# Altium schematic sheet 5_non_volatile_memory.schdoc: Non Volatile Memory
size A4; Engineer: Eng_2_ALT; Revision: v0.7; SheetNumber: 5; SheetTotal: 6; Designed by: André M. P. Mattos; Version: v0.7; ProjectCode: obdh2
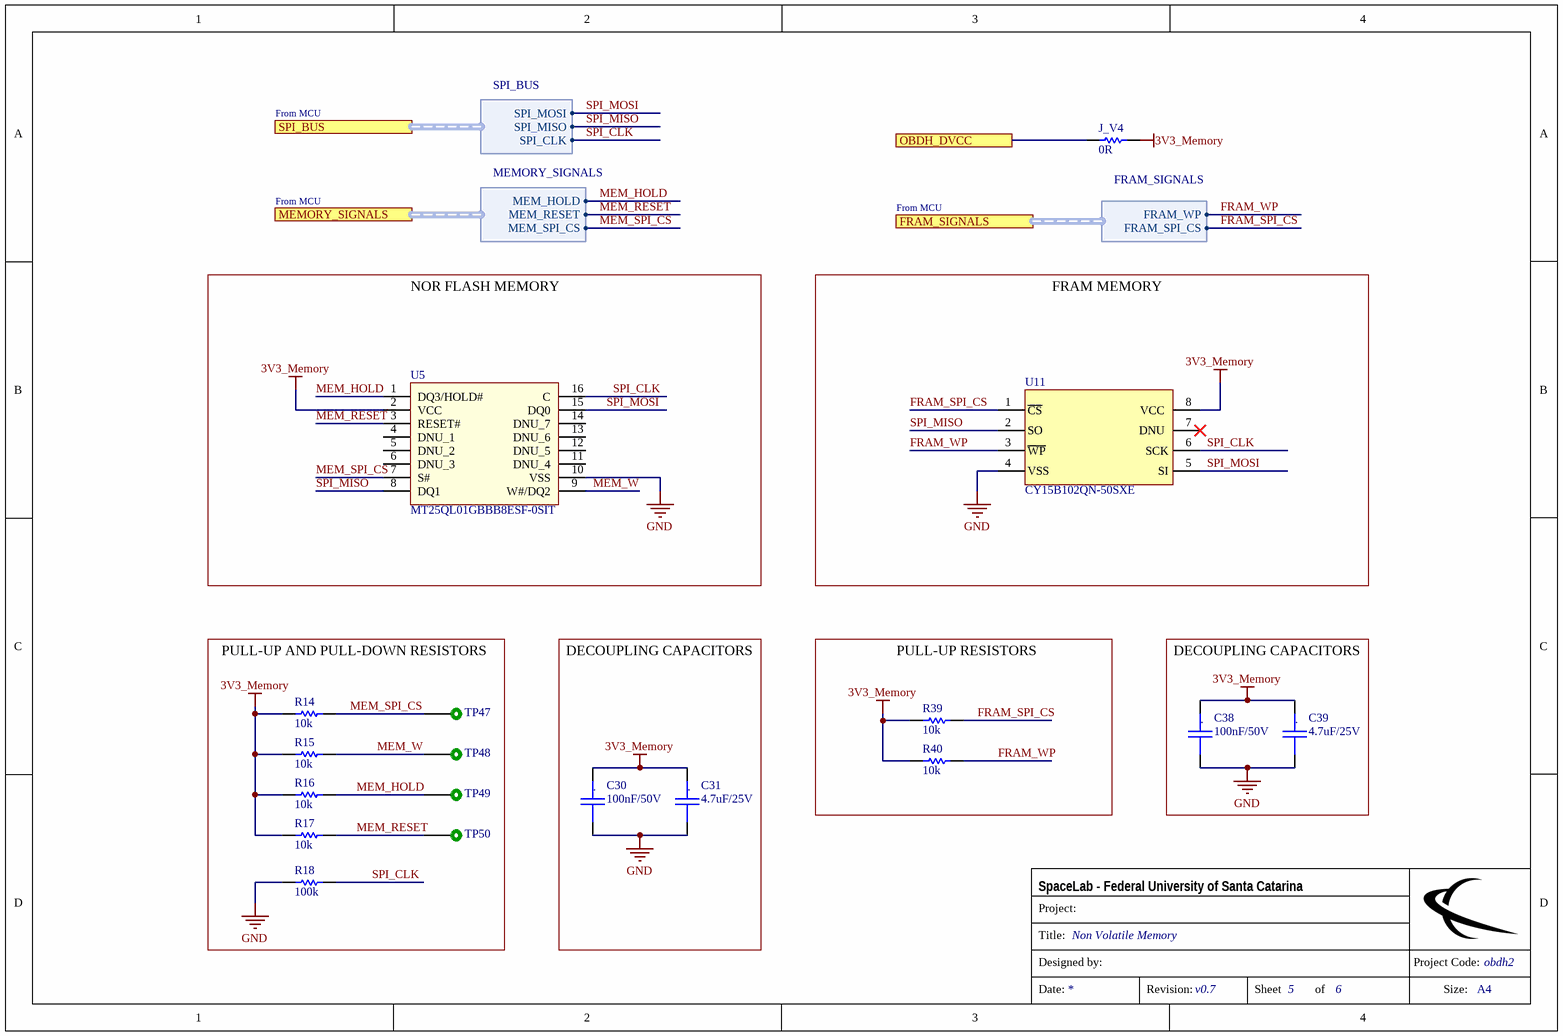
[diagram p0: 5_non_volatile_memory.schdoc]

## Parts
C30  100nF/50V  [CC0805]
C31  4.7uF/25V  [CC0805]
C38  100nF/50V  [CC0805]
C39  4.7uF/25V  [CC0805]
J_V4  0R  [0805]
R14  10k  [0805]
R15  10k  [0805]
R16  10k  [0805]
R17  10k  [0805]
R18  100k  [0805]
R39  10k  [0805]
R40  10k  [0805]
TP47  TEST_POINT_2  [TEST_POINT_2]  (value not drawn)  (no BOM)
TP48  TEST_POINT_2  [TEST_POINT_2]  (value not drawn)  (no BOM)
TP49  TEST_POINT_2  [TEST_POINT_2]  (value not drawn)  (no BOM)
TP50  TEST_POINT_2  [TEST_POINT_2]  (value not drawn)  (no BOM)
U5  MT25QL01GBBB8ESF-0SIT  [SOIC127P1032X265-16N]
U11  CY15B102QN-50SXE  [SOIC8]

## Blocks framed on the sheet
NOR FLASH MEMORY: U5
FRAM MEMORY: U11
PULL-UP AND PULL-DOWN RESISTORS: R14-R18 TP47-TP50
DECOUPLING CAPACITORS: C30 C31
PULL-UP RESISTORS: R39 R40
DECOUPLING CAPACITORS: C38 C39

## Ports
FRAM_SIGNALS (harness FRAM_SIGNALS), MEMORY_SIGNALS (harness MEMORY_SIGNALS), OBDH_DVCC, SPI_BUS (harness SPI_BUS)

## Harnesses
SPI_BUS: SPI_CLK, SPI_MISO, SPI_MOSI
MEMORY_SIGNALS: MEM_SPI_CS, MEM_RESET, MEM_HOLD
FRAM_SIGNALS: FRAM_SPI_CS, FRAM_WP

## Nets
3V3_Memory: C30.1 C31.1 C38.1 C39.1 J_V4.1 R14.2 R15.2 R16.2 R17.2 R39.2 R40.2 U5.2(VCC) U11.8(VCC)
GND: C30.2 C31.2 C38.2 C39.2 R18.2 U5.10(VSS) U11.4(VSS)
FRAM_SPI_CS: R39.1 U11.1(~{CS}) ; port FRAM_SIGNALS.FRAM_SPI_CS
FRAM_WP: R40.1 U11.3(~{WP}) ; port FRAM_SIGNALS.FRAM_WP
MEM_HOLD: R16.1 TP49.1 U5.1(DQ3/HOLD#) ; port MEMORY_SIGNALS.MEM_HOLD
MEM_RESET: R17.1 TP50.1 U5.3(RESET#) ; port MEMORY_SIGNALS.MEM_RESET
MEM_SPI_CS: R14.1 TP47.1 U5.7(S#) ; port MEMORY_SIGNALS.MEM_SPI_CS
MEM_W: R15.1 TP48.1 U5.9(W#/DQ2)
OBDH_DVCC: J_V4.2 ; port OBDH_DVCC
SPI_CLK: R18.1 U5.16(C) U11.6(SCK) ; port SPI_BUS.SPI_CLK
SPI_MISO: U5.8(DQ1) U11.2(SO) ; port SPI_BUS.SPI_MISO
SPI_MOSI: U5.15(DQ0) U11.5(SI) ; port SPI_BUS.SPI_MOSI

Not connected (* = marked no-connect by the designer): U5 4(DNU_1) 5(DNU_2) 6(DNU_3) 11(DNU_4) 12(DNU_5) 13(DNU_6) 14(DNU_7); U11 7(DNU)*

## Notes on the sheet
- From MCU
- Project:
- SpaceLab - Federal University of Santa Catarina
- Title:
- Designed by:
- Project Code:
- Date:
- Revision:
- Sheet
- of
- Size:
- A4
- (in symbol Cap_Cer_X7R_4.7uF_25V_0805) .
- (in symbol Cap_Cer_X7R_100nF_50V_0603) .

## Library data of the parts
C30 C38 = Cap_Cer_X7R_100nF_50V_0603: CAP CER 100nF 50V 0603 10%; Partnumber: C0603C104K5RAC3121; NCM: 8532.24.10
C31 C39 = Cap_Cer_X7R_4.7uF_25V_0805: CAP CER 4.7UF 25V 10% X7R 0805; Partnumber: C0805C475K3RACAUTO; NCM: 8532.24.10
J_V4 = R0R_JUMPER_1/8W_0805: RES 0R OHM 1/8W JUMPER 0805; Partnumber: CRCW08050000Z0EA; NCM: 8533.21.20
R14-R17 R39 R40 = R10k_1%_1/8W_0805: RES 10K OHM 1/8W 1%  0805; Partnumber: CRCW080510K0FKEA; NCM: 8533.21.20
R18 = R100k_1%_1/8W_0805: RES 100K OHM 1/8W 1% 0805; Partnumber: AC0805FR-13100KL; NCM: 8533.21.20
TP47-TP50 = TEST_POINT_2: Test point
U5 = MT25QL01GBBB8ESF-0SIT: IC FLASH 1GBIT 108MHZ 16SOIC; Manufacturer_Name: Micron; Geometry.Height: 2.65mm; Partnumber: MT25QL01GBBB8ESF-0SIT; Mouser Part Number: 340-278808-TRAY; Mouser Price/Stock: https://www.mouser.com/Search/Refine.aspx?Keyword=340-278808-TRAY; RS Part Number: *; RS Price/Stock: *; Datasheet Link: https://www.micron.com/~/media/documents/products/data-sheet/nor-flash/serial-nor/mt25q/die-rev-b/mt25q_qlkt_l_01g_bbb_0.pdf
U11 = CY15B102QN-50SXE: FRAM (Ferroelectric RAM) Memory IC 2Mb (256K x 8) SPI 50 MHz 8-SOIC; Partnumber: CY15B102QN-50SXE